# Altium schematic sheet DSO_Trig.SchDoc: Schematic_Name
size A4; CompanyName: University of Melbourne; Engineer: Your Name Here; DocumentNumber: 1; Revision: 0.1; SheetNumber: 1; SheetTotal: 1; Title_Project: Project_Title; StudentNo: Student No.
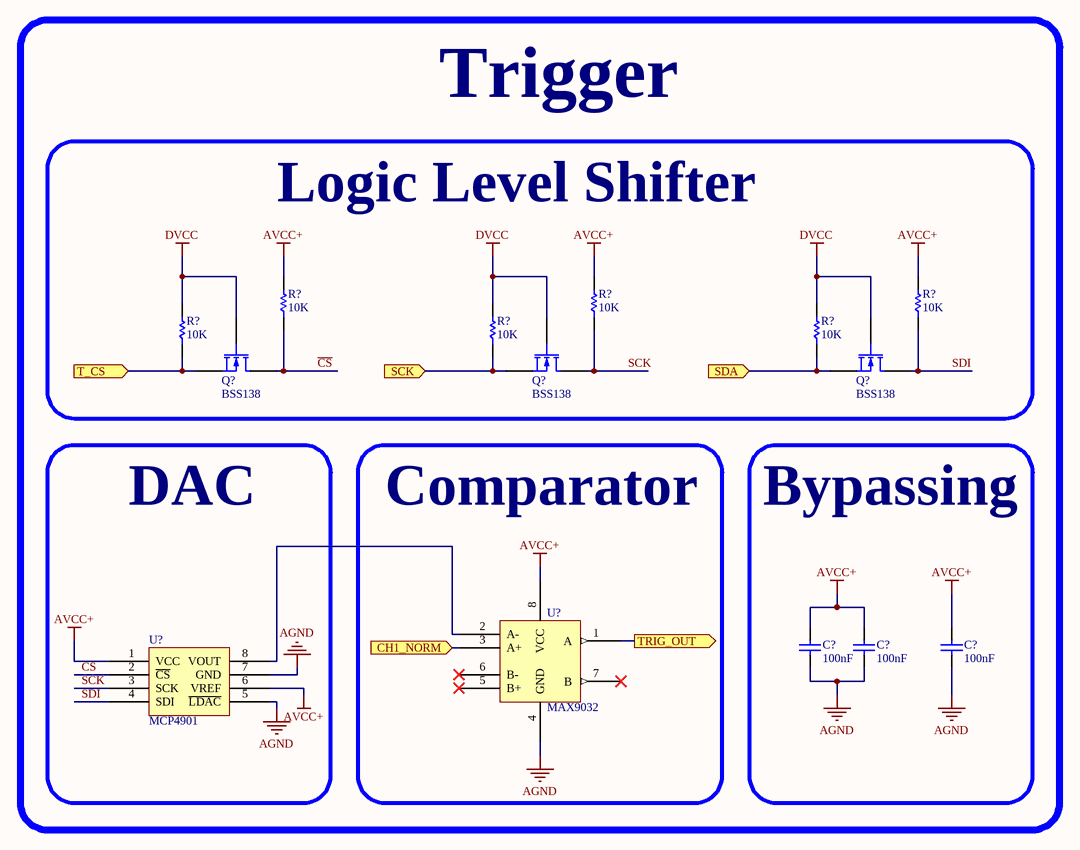
[diagram p0: DSO_Trig.SchDoc]

## Parts
(Parts that share a designator on the sheet are numbered #1, #2 ... from top to bottom, then left to right.)
C?#1  100nF  [0805C]
C?#2  100nF  [0805C]
C?#3  100nF  [0805C]
Q?#1  BSS138  [SOT23]
Q?#2  BSS138  [SOT23]
Q?#3  BSS138  [SOT23]
R?#1  10K  [0805]
R?#2  10K  [0805]
R?#3  10K  [0805]
R?#4  10K  [0805]
R?#5  10K  [0805]
R?#6  10K  [0805]
U?#1  MAX9032  [SOIC-8]
U?#2  MCP4901  [SOIC-8]

## Blocks framed on the sheet
Logic Level Shifter: Q?#1-Q?#3 R?#1-R?#6
DAC: U?#2
Comparator: U?#1
Bypassing: C?#1-C?#3

## Ports
CH1_NORM (in), SCK (in), SDA (in), T_CS (in), TRIG_OUT (out)

## Nets
AGND: C?#1.1 C?#2.1 C?#3.1 U?#1.4(GND) U?#2.5(~{LDAC}) U?#2.7(GND)
AVCC+: C?#1.2 C?#2.2 C?#3.2 R?#1.2 R?#2.2 R?#3.2 U?#1.8(VCC) U?#2.1(VCC) U?#2.6(VREF)
DVCC: Q?#1.1 Q?#2.1 Q?#3.1 R?#4.2 R?#5.2 R?#6.2
~{CS}: Q?#1.3 R?#1.1 U?#2.2(~{CS})
CH1_NORM: U?#1.3(A+) ; port CH1_NORM
SCK: Q?#2.3 R?#2.1 U?#2.3(SCK)
SCK: Q?#2.2 R?#5.1 ; port SCK  [a separate net that carries the same name]
SDA: Q?#3.2 R?#6.1 ; port SDA
SDI: Q?#3.3 R?#3.1 U?#2.4(SDI)
T_CS: Q?#1.2 R?#4.1 ; port T_CS
TRIG_OUT: U?#1.1(A) ; port TRIG_OUT
NetU?#1_2: U?#1.2(A-) U?#2.8(VOUT)

Not connected (* = marked no-connect by the designer): U?#1 5(B+)* 6(B-)* 7(B)*

## Notes on the sheet
- Trigger

## Library data of the parts
C?#1-C?#3 = C: Capacitor; Reviewed by: RM - 2018/08/05; Revision: July-2002: Re-released for DXP Platform.; Supplier 1: *; Supplier Part Number 1: *; Value: 100nF
Q?#1-Q?#3 = MOSFET-N: N-Channel MOSFET; PackageDocument: 1995/1996; Published: 8-Jun-2000; LatestRevisionDate: 17-Jul-2002; LatestRevisionNote: Re-released for DXP Platform.; PackageReference: E3; Publisher: Altium Limited
R?#1-R?#6 = R: Resistor; Reviewed by: RM - 2018/08/05; Supplier 1: *; Suppler Part Number 1: *; Value: 10K
U?#1 = MAX9032: Dual Comparator; Reviewed by: RM - 2018/08/05; Supplier 1: Digi-Key; Supplier Part Number 1: MAX9032ASA-ND
U?#2 = MCP4901: DAC 8bit SPI; Reviewed by: RM - 2018/08/05; Supplier 1: Digi-Key; Supplier Part Number 1: MCP4901-E/SN-ND